# EAGLE design H0BR40 (EAGLE 9.3.0)

## Sheet 1 of 2
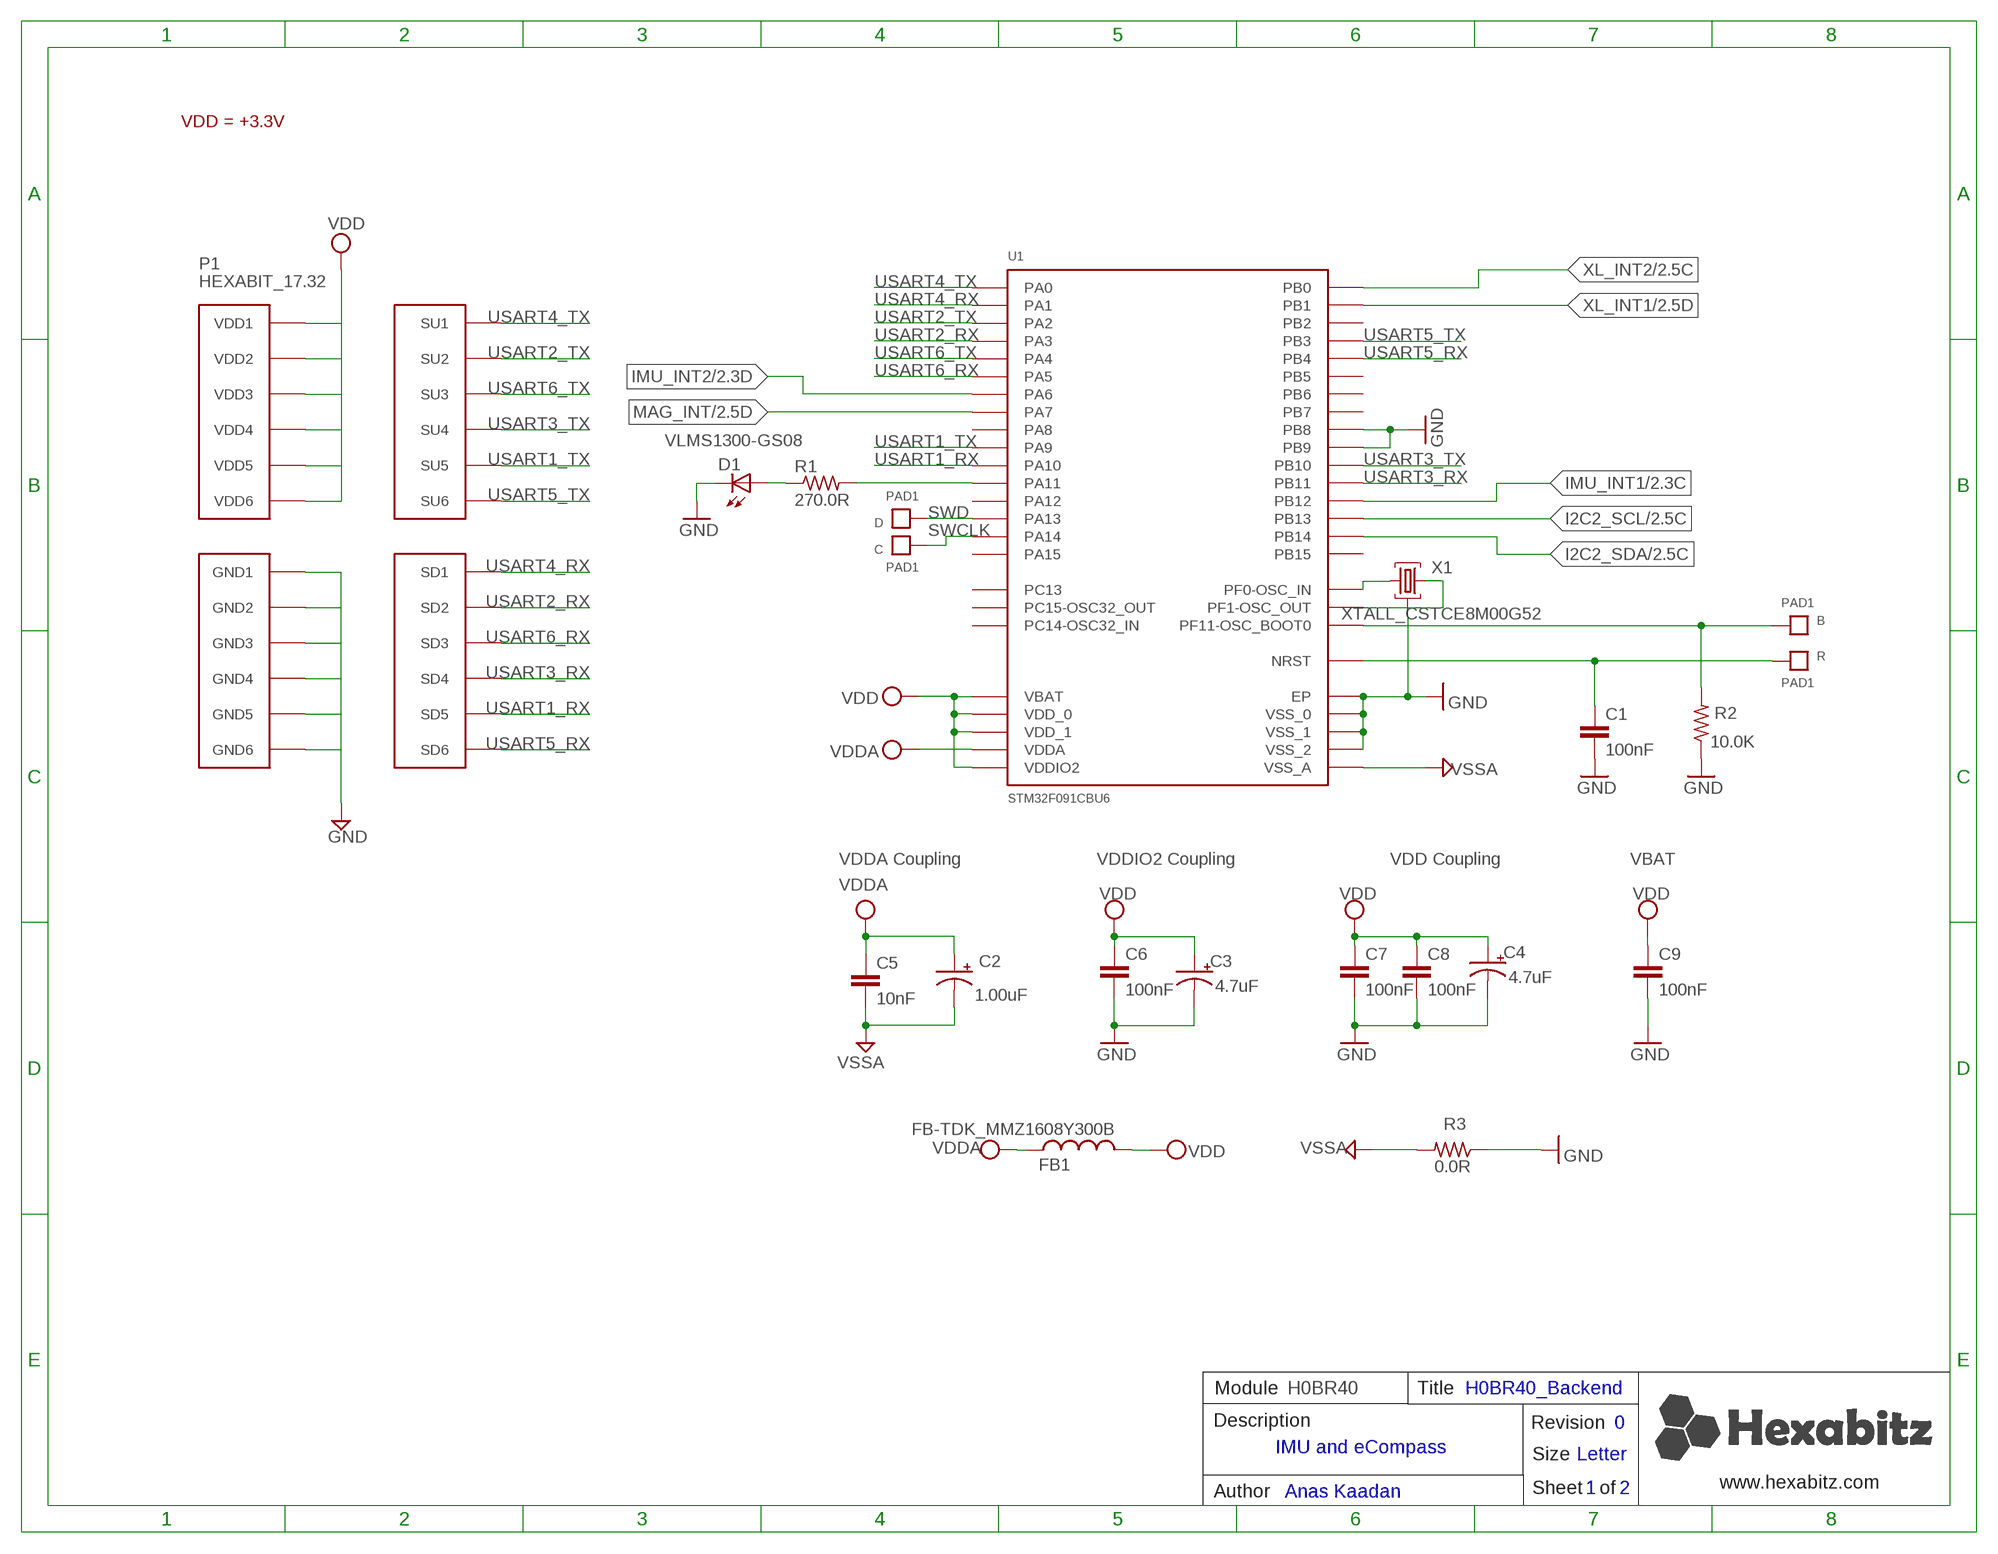
[diagram p0: schematic, sheet 1]

### Parts
B  PAD1  [PAD1]
C  PAD1  [PAD1]
C1  100nF  C-0603  [C-0603]
C2  1.00uF  C-0805-POL  [C-0805-POL]
C3  4.7uF  C-0805-POL  [C-0805-POL]
C4  4.7uF  C-0805-POL  [C-0805-POL]
C5  10nF  C-0603  [C-0603]
C6  100nF  C-0603  [C-0603]
C7  100nF  C-0603  [C-0603]
C8  100nF  C-0603  [C-0603]
C9  100nF  C-0603  [C-0603]
D  PAD1  [PAD1]
D1  VLMS1300-GS08  [VLMS1300-GS08]
FB1  FB-TDK_MMZ1608Y300B  [FB-TDK_MMZ1608Y300B]
P1  HEXABIT_17.32  [HEXABIT_17.32]
R  PAD1  [PAD1]
R1  270.0R  R-0603  [R-0603]
R2  10.0K  R-0603  [R-0603]
R3  0.0R  R-0603  [R-0603]
U1  STM32F091CBU6  [STM32F091CBU6]
X1  XTALL_CSTCE8M00G52  [XTALL_CSTCE8M00G52]

### Nets
B1: B.P$1 B.P$2 R2.2 U1.P$44(PF11-OSC_BOOT0)
GND: C1.2 C3.2(-) C4.2(-) C6.2 C7.2 C8.2 C9.2 D1.C P1.PAD_PD7(GND1) P1.PAD_PD8(GND2) P1.PAD_PD9(GND3) P1.PAD_PD10(GND4) P1.PAD_PD11(GND5) P1.PAD_PD12(GND6) R2.1 R3.1 U1.EP U1.P$23(VSS_0) U1.P$35(VSS_1) U1.P$45(PB8) U1.P$46(PB9) U1.P$47(VSS_2) X1.P$2 ; also sheet 2
I2C2_SCL: U1.P$26(PB13) ; also sheet 2
I2C2_SDA: U1.P$27(PB14) ; also sheet 2
IMU_INT1: U1.P$25(PB12) ; also sheet 2
IMU_INT2: U1.P$16(PA6) ; also sheet 2
MAG_INT: U1.P$17(PA7) ; also sheet 2
N$3: R1.2 U1.P$32(PA11)
N$4: D1.A R1.1
N$5: U1.P$5(PF0-OSC_IN) X1.P$1
N$6: U1.P$6(PF1-OSC_OUT) X1.P$3
R1: C1.1 R.P$1 R.P$2 U1.P$7(NRST)
SWCLK: C.P$1 C.P$2 U1.P$37(PA14)
SWD: D.P$1 D.P$2 U1.P$34(PA13)
USART1_RX: P1.PAD_PD5(SD5) U1.P$31(PA10)
USART1_TX: P1.PAD_PU5(SU5) U1.P$30(PA9)
USART2_RX: P1.PAD_PD2(SD2) U1.P$13(PA3)
USART2_TX: P1.PAD_PU2(SU2) U1.P$12(PA2)
USART3_RX: P1.PAD_PD4(SD4) U1.P$22(PB11)
USART3_TX: P1.PAD_PU4(SU4) U1.P$21(PB10)
USART4_RX: P1.PAD_PD1(SD1) U1.P$11(PA1)
USART4_TX: P1.PAD_PU1(SU1) U1.P$10(PA0)
USART5_RX: P1.PAD_PD6(SD6) U1.P$40(PB4)
USART5_TX: P1.PAD_PU6(SU6) U1.P$39(PB3)
USART6_RX: P1.PAD_PD3(SD3) U1.P$15(PA5)
USART6_TX: P1.PAD_PU3(SU3) U1.P$14(PA4)
VDD: C3.1(+) C4.1(+) C6.1 C7.1 C8.1 C9.1 FB1.2 P1.PAD_PU7(VDD1) P1.PAD_PU8(VDD2) P1.PAD_PU9(VDD3) P1.PAD_PU10(VDD4) P1.PAD_PU11(VDD5) P1.PAD_PU12(VDD6) U1.P$1(VBAT) U1.P$24(VDD_0) U1.P$36(VDDIO2) U1.P$48(VDD_1) ; also sheet 2
VDDA: C2.1(+) C5.1 FB1.1 U1.P$9(VDDA)
VSSA: C2.2(-) C5.2 R3.2 U1.P$8(VSS_A)
XL_INT1: U1.P$19(PB1) ; also sheet 2
XL_INT2: U1.P$18(PB0) ; also sheet 2
Unconnected: U1.P$2(PC13) U1.P$3(PC14-OSC32_IN) U1.P$4(PC15-OSC32_OUT) U1.P$20(PB2) U1.P$28(PB15) U1.P$29(PA8) U1.P$33(PA12) U1.P$38(PA15) U1.P$41(PB5) U1.P$42(PB6) U1.P$43(PB7)

### Notes on the sheet
- VDD = +3.3V
- VDDA Coupling | VDDIO2 Coupling | VDD Coupling | VBAT
- Module | H0BR40 | Title | H0BR40_Backend
- Description | Revision | 0
- IMU and eCompass
- Size | Letter
- www.hexabitz.com
- Author | Anas Kaadan | Sheet   of | 1 | 2
- C:/Users/Admin/Desktop/logodraft.bmp

## Sheet 2 of 2
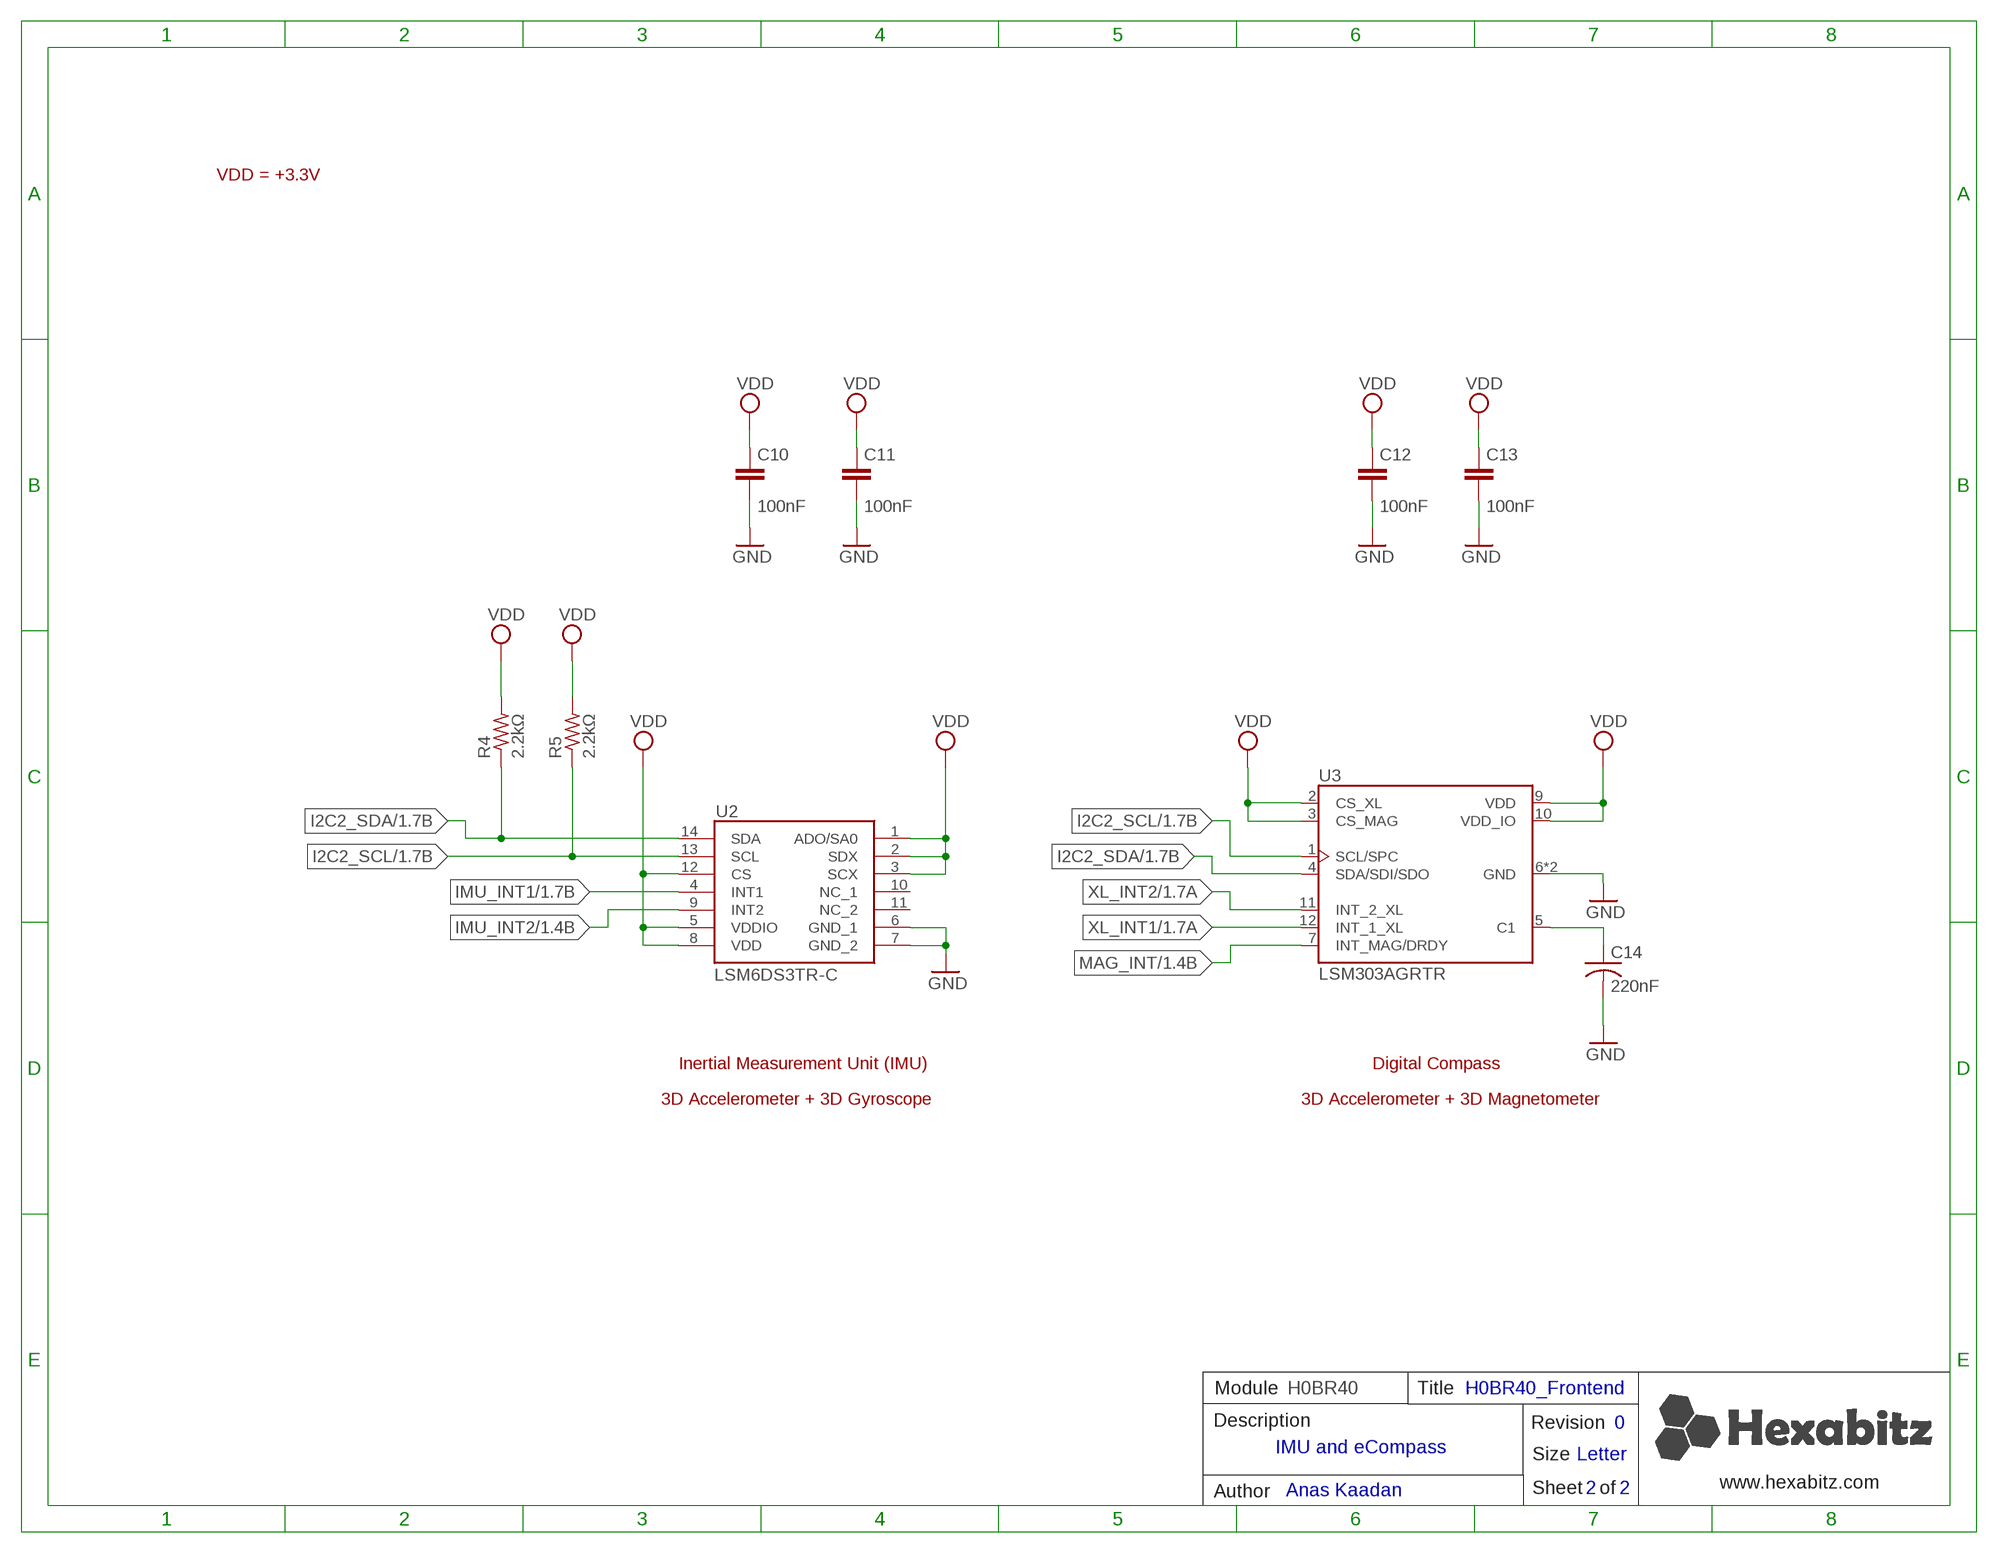
[diagram p1: schematic, sheet 2]

### Parts
C10  100nF  C-0603  [C-0603]
C11  100nF  C-0603  [C-0603]
C12  100nF  C-0603  [C-0603]
C13  100nF  C-0603  [C-0603]
C14  220nF  C-0805  [C-0805]
R4  2.2kΩ  R-0603  [R-0603]
R5  2.2kΩ  R-0603  [R-0603]
U2  LSM6DS3TR-C  [LGA-14(2.5X3X0.86)]
U3  LSM303AGRTR  [LGA12R50P_200X200X100]

### Nets
GND: C10.2 C11.2 C12.2 C13.2 C14.2 U2.6(GND_1) U2.7(GND_2) U3.6(GND) U3.8(GND) ; also sheet 1
I2C2_SCL: R5.1 U2.13(SCL) U3.1(SCL/SPC) ; also sheet 1
I2C2_SDA: R4.1 U2.14(SDA) U3.4(SDA/SDI/SDO) ; also sheet 1
IMU_INT1: U2.4(INT1) ; also sheet 1
IMU_INT2: U2.9(INT2) ; also sheet 1
MAG_INT: U3.7(INT_MAG/DRDY) ; also sheet 1
N$1: C14.1 U3.5(C1)
VDD: C10.1 C11.1 C12.1 C13.1 R4.2 R5.2 U2.1(ADO/SA0) U2.2(SDX) U2.3(SCX) U2.5(VDDIO) U2.8(VDD) U2.12(CS) U3.2(CS_XL) U3.3(CS_MAG) U3.9(VDD) U3.10(VDD_IO) ; also sheet 1
XL_INT1: U3.12(INT_1_XL) ; also sheet 1
XL_INT2: U3.11(INT_2_XL) ; also sheet 1
Unconnected: U2.10(NC_1) U2.11(NC_2)

### Notes on the sheet
- VDD = +3.3V
- Inertial Measurement Unit (IMU) | Digital Compass
- 3D Accelerometer + 3D Gyroscope | 3D Accelerometer + 3D Magnetometer
- Module | H0BR40 | Title | H0BR40_Frontend
- Description | Revision | 0
- IMU and eCompass
- Size | Letter
- www.hexabitz.com
- Author | Anas Kaadan | Sheet   of | 2 | 2

## Library data of the parts
B C D R = Hexabitz:PAD1
C1 C6-C8 = Hexabitz:C-0603: CAP CER 10% X7R 0603; CAPACITANCE: 100nF; MFN: AVX; MPN: 0603YC104K4T2A; OCTOPART_URL: https://octopart.com/0603yc104k4t2a-avx+interconnect+%2F+elco-8120651; TOLERANCE: 10%; VOLTAGE_RATING: 16.0 V
C2 = Hexabitz:C-0805-POL: Cap Tant Solid SMD 2012; CAPACITANCE: 1.00uF; MFN: AVX; MPN: TAJR105M016RNJ; OCTOPART_URL: http://octopart.com/tajr105m016rnj-avx-1188552; TOLERANCE: 10%; VOLTAGE_RATING: 16.0 V
C3 = Hexabitz:C-0805-POL: Cap Tant Solid SMD 2012; CAPACITANCE: 4.7uF; MFN: Panasonic; MPN: 10TPU4R7MSI; OCTOPART_URL: https://octopart.com/10tpu4r7msi-panasonic-29487748; TOLERANCE: 20%; VOLTAGE_RATING: 10.0 V
C4 = Hexabitz:C-0805-POL: Cap Tant Solid SMD 2012; CAPACITANCE: 4.7uF; MFN: Panasonic; MPN: 10TPU4R7MSI; OCTOPART_URL: https://octopart.com/10tpu4r7msi-panasonic-29487748; TOLERANCE: 10%; VOLTAGE_RATING: 10 V
C5 = Hexabitz:C-0603: CAP CER 10% X7R 0603; CAPACITANCE: 10nF; MFN: AVX; MPN: 0603YC103KAT4A; OCTOPART_URL: https://octopart.com/0603yc103kat4a-avx+interconnect+%2F+elco-2550362; TOLERANCE: 10%; VOLTAGE_RATING: 16.0 V
C9 = Hexabitz:C-0603: CAP CER 10% X7R 0603; CAPACITANCE: 100nF; MFN: AVX; MPN: 0603YC104K4T2A; OCTOPART_URL: https://octopart.com/0603yc104k4t2a-avx+interconnect+%2F+elco-8120651; TOLERANCE: 16.0 V; VOLTAGE_RATING: 10%
C10-C13 = Hexabitz:C-0603: CAP CER 10% X7R 0603; CAPACITANCE: 100nF; MFN: AVX; MPN: 0603YC104K4T2A; OCTOPART_URL: https://octopart.com/0603yc104k4t2a-avx+interconnect+%2F+elco-8120651; TOLERANCE: ±10%; VOLTAGE_RATING: 16.0V
C14 = Hexabitz:C-0805; CAPACITANCE: 220nF; MFN: KEMET; MPN: C0805C224K1RACTU; OCTOPAR_URL: https://octopart.com/c0805c224k1ractu-kemet-12818106; TOLERANCE: ±10%; VOLTAGE_RATING: 100.0V
D1 = Hexabitz:VLMS1300-GS08: Red 0603 130° Clear 54 mcd 2 V Surface Mount ChipLED ; Octopart Url : http://octopart.com/vlms1300-gs08-vishay-21709201; MFN: Vishay; MPN: VLMS1300-GS08; OCTOPART_URL: https://octopart.com/vlms1300-gs08-vishay-21709201?r=sp&s=_gcP4_q8T1SC6PJQPTQ9yA
FB1 = Hexabitz:FB-TDK_MMZ1608Y300B: Ferrite Beads Multi-Layer 30Ohm 25% 100MHz 1.5A 50mOhm DCR 0603; MFN: TDK; MPN: MMZ1608Y300B; OCTOPART_URL: https://octopart.com/mmz1608y300b-tdk-368280?r=sp&s=cd9_2ZEqQ9q9UNBuQgHAiA
P1 = Hexabitz:HEXABIT_?: Hexabitz Hexagon Module Connector Hexagon side length = 17.32mm.
R1 = Hexabitz:R-0603: Thick Film Resistors - SMD 0603; MFN: Panasonic; MPN: ERJ-3GEYJ271V; OCTOPART_URL: https://octopart.com/erj-3geyj271v-panasonic-55560546; RESISTANCE: 270.0 Ohm; TOLERANCE: 5%
R2 = Hexabitz:R-0603: Thick Film Resistors - SMD 0603; MFN: Vishay; MPN: CRCW060310K0JNEB; OCTOPART_URL: https://octopart.com/crcw060310k0jneb-vishay-46603269; RESISTANCE: 10.0K Ohm; TOLERANCE: 5%
R3 = Hexabitz:R-0603: Thick Film Resistors - SMD 0603; MFN: Vishay; MPN: CRCW06030000Z0EAHP; OCTOPART_URL: https://octopart.com/crcw06030000z0eahp-vishay-44320230; RESISTANCE: 0.0 Ohm
R4 = Hexabitz:R-0603: Thick Film Resistors - SMD 0603; MFN: Vishay; MPN: CRCW06032K20FKEA; OCTOPART_URL: https://octopart.com/crcw06032k20fkea-vishay-40018987; RESISTANCE: 2.2kΩ; TOLERANCE: ±1%
R5 = Hexabitz:R-0603: Thick Film Resistors - SMD 0603; MFN: Vishay; MPN: CRCW06032K20FKEA; OCTOPART_URL: https://octopart.com/crcw06032k20fkea-vishay-40018987; RESISTANCE: 2.2 kΩ; TOLERANCE: ±1%
U1 = Hexabitz:STM32F091CBU6: Description : ARM-based 32-bit MCU, CAN, 12 timers, ADC, DAC & Comm. Interface, 2 to 3.6 V, -40 to 85 degC, 48-Pin UFQFPN, RoHS, Tray ;Parameter : Ciiva URL : https://ciiva.com/part/STM32F091CBU6-20240708, CiivaID : 20240708, Clock Speed : 48000000.0 Hz, Lifecycle Status : Active, Mounting Style : Surface Mount, Number of Pins : 48, Octopart Url : https://octopart.com/stm32f091cbu6-stmicroelectronics-51988677, OctopartID : 5f4f955c32ec8088, RAM Memory Size : 32768 B, REACH SVHC Compliance : No SVHC, RoHS : Compliant,; MFN: STMicroelectronics; MPN: STM32F091CBU6; OCTOPART_URL: https://octopart.com/stm32f091cbu6-stmicroelectronics-51988677?r=sp&s=bU6fpgsrTZOxHyt7jkfh3w
U2 = Hexabitz:LSM6DS3TR-C: STMicroelectronics iNEMO inertial module: 3D accelerometer and 3D gyroscope Source: Datasheet <http://www.st.com/resource/en/datasheet/lsm6ds3tr-c.pdf>; DESCRIPTION: STMicroelectronics iNEMO inertial module: 3D accelerometer and 3D gyroscope; HEIGHT: mm; MFN: STMicroelectronics; MPN: LSM6DS3TR-C; OCTOPART_ID: b93b7300354766fc; OCTOPART_URL: https://www.mouser.com/Search/Refine.aspx?Keyword=N%2FA
U3 = Hexabitz:LSM303AGRTR: Ultra-compact high-performance e-compass 3D accelerometer and 3D magnetometer module; DESCRIPTION: Ultra-compact high-performance e-compass 3D accelerometer and 3D magnetometer module; MFN: STMicroelectronics; MPN: LSM303AGRTR; OCTOPART_ID: 497-16527-1-ND; OCTOPART_URL: https://www.digikey.com/product-detail/en/stmicroelectronics/LSM303AGRTR/497-16527-1-ND/6006105?utm_source=snapeda&utm_medium=aggregator&utm_campaign=symbol; PACKAGE: LGA-12 STMicroelectronics
X1 = Hexabitz:XTALL_CSTCE8M00G52: MURATA CSTCE8M00G52-R0 RESONATOR, SMD, 8MHZ ; Octopart Url : https://octopart.com/cstce8m00g52-r0-murata-7145559; MFN: Murata; MPN: CSTCE8M00G52Z-R0; OCTOPART_URL: https://octopart.com/cstce8m00g52z-r0-murata-17755941?r=sp&s=JDnNJnrHQhyS8Zk4ofFWXw

## Board
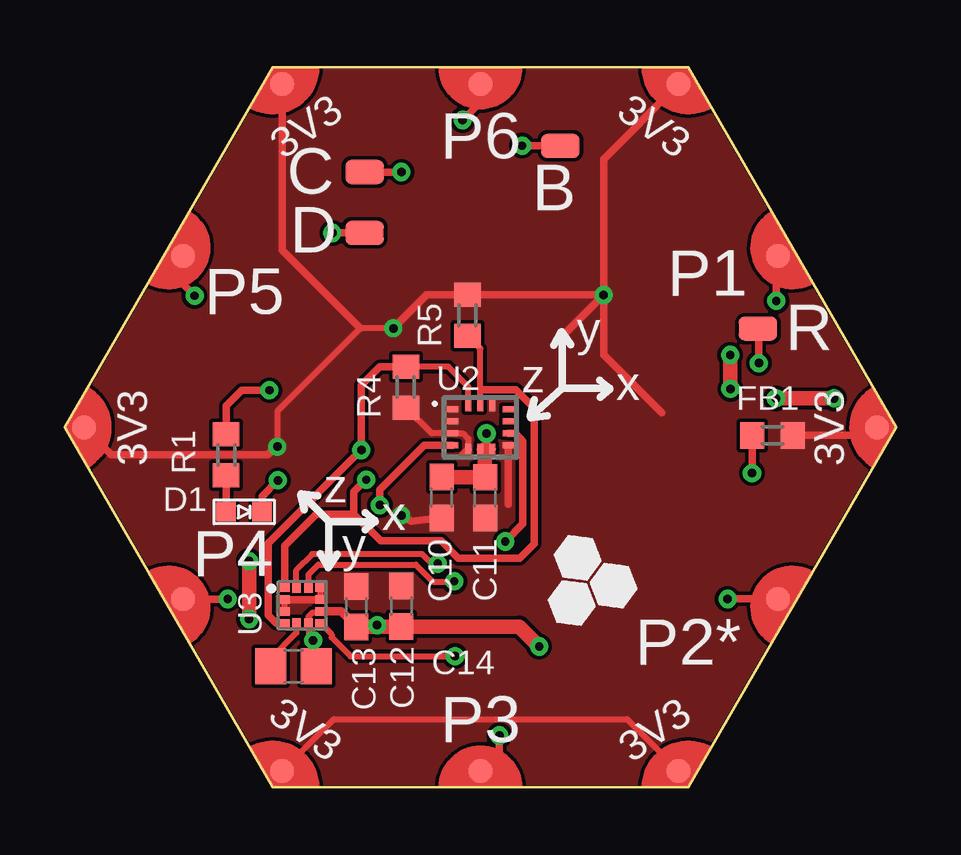
[diagram p2: board, top side]
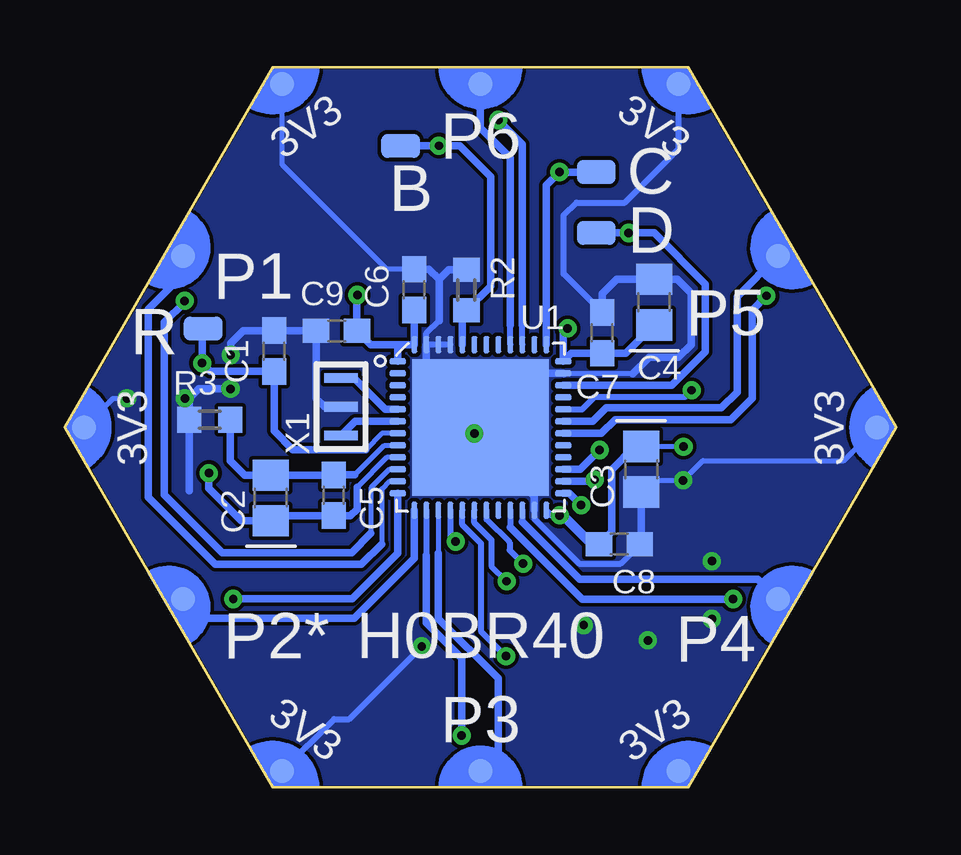
[diagram p3: board, bottom side, seen from below]

Size 34.64 x 30 mm. Coordinates in mm from the lower left corner, seen from the top.
Copper layers (1*16): Top 0.035mm / dielectric 1.5mm / Bottom 0.035mm
Design rules "2_layer": minimum track width 7mil, minimum drill 10mil, track to track 6mil, track to pad 6mil, pad to pad 6mil, via to via 6mil, smd to smd 0mil, copper to edge 1mil, drill to drill 8mil, minimum pad ring 10mil, minimum via ring 8mil, stop-mask expansion 2mil, vias tented up to drill 15mil, thermal gap 10mil

### Footprints (pad centres in the part's own frame; a part is rotated, then mirrored left to right if it is on the bottom)
PAD1 = smd 1.6 x 1: P$1 0,0 | smd 1.6 x 1 bottom: P$2 0,0
C-0603 = smd 1.1 x 1: 1 -0.85,0; 2 0.85,0
C-0805-POL = smd 1.3 x 1.5: 1 -0.95,0; 2 0.95,0
C-0805 = smd 1.3 x 1.5: 1 -0.95,0; 2 0.95,0
VLMS1300-GS08 = smd 0.8 x 0.8: A 0,0.75; C 0,-0.75
FB-TDK_MMZ1608Y300B = smd 1 x 1.1: 1 -0.85,0; 2 0.85,0
HEXABIT_17.32 = smd 1 x 1 bottom: PAD_PD1 12.39,7.15; PAD_PD2 12.39,-7.15; PAD_PD3 0,-14.31; PAD_PD4 -12.39,-7.15; PAD_PD5 -12.39,7.15; PAD_PD6 0,14.31; PAD_PD7 8.26,14.31; PAD_PD8 16.52,0; PAD_PD9 8.26,-14.31; PAD_PD10 -8.26,-14.31; PAD_PD11 -16.52,0; PAD_PD12 -8.26,14.31 | smd 1 x 1: PAD_PU1 12.39,7.15; PAD_PU2 12.39,-7.15; PAD_PU3 0,-14.31; PAD_PU4 -12.39,-7.15; PAD_PU5 -12.39,7.15; PAD_PU6 0,14.31; PAD_PU7 8.26,14.31; PAD_PU8 16.52,0; PAD_PU9 8.26,-14.31; PAD_PU10 -8.26,-14.31; PAD_PU11 -16.52,0; PAD_PU12 -8.26,14.31
R-0603 = smd 1 x 1.1: 1 -0.85,0; 2 0.85,0
STM32F091CBU6 = smd 5.7 x 5.7: EP 0,0 | smd 0.25 x 0.7: P$1 -2.75,-3.45; P$2 -2.25,-3.45; P$3 -1.75,-3.45; P$4 -1.25,-3.45; P$5 -0.75,-3.45; P$6 -0.25,-3.45; P$7 0.25,-3.45; P$8 0.75,-3.45; P$9 1.25,-3.45; P$10 1.75,-3.45; P$11 2.25,-3.45; P$12 2.75,-3.45; P$25 2.75,3.45; P$26 2.25,3.45; P$27 1.75,3.45; P$28 1.25,3.45; P$29 0.75,3.45; P$30 0.25,3.45; P$31 -0.25,3.45; P$32 -0.75,3.45; P$33 -1.25,3.45; P$34 -1.75,3.45; P$35 -2.25,3.45; P$36 -2.75,3.45 | smd 0.7 x 0.25: P$13 3.45,-2.75; P$14 3.45,-2.25; P$15 3.45,-1.75; P$16 3.45,-1.25; P$17 3.45,-0.75; P$18 3.45,-0.25; P$19 3.45,0.25; P$20 3.45,0.75; P$21 3.45,1.25; P$22 3.45,1.75; P$23 3.45,2.25; P$24 3.45,2.75; P$37 -3.45,2.75; P$38 -3.45,2.25; P$39 -3.45,1.75; P$40 -3.45,1.25; P$41 -3.45,0.75; P$42 -3.45,0.25; P$43 -3.45,-0.25; P$44 -3.45,-0.75; P$45 -3.45,-1.25; P$46 -3.45,-1.75; P$47 -3.45,-2.25; P$48 -3.45,-2.75
LGA-14(2.5X3X0.86) = smd 0.475 x 0.25: 1 -1.163,0.75; 2 -1.163,0.25; 3 -1.163,-0.25; 4 -1.163,-0.75; 8 1.163,-0.75; 9 1.163,-0.25; 10 1.163,0.25; 11 1.163,0.75 | smd 0.25 x 0.475: 5 -0.5,-0.912; 6 0,-0.912; 7 0.5,-0.912; 12 0.5,0.912; 13 0,0.912; 14 -0.5,0.912
LGA12R50P_200X200X100 = smd 0.45 x 0.35: 1 -0.76,0.75; 2 -0.76,0.25; 3 -0.76,-0.25; 4 -0.76,-0.75; 7 0.76,-0.75; 8 0.76,-0.25; 9 0.76,0.25; 10 0.76,0.75 | smd 0.35 x 0.45: 5 -0.25,-0.76; 6 0.25,-0.76; 11 0.25,0.76; 12 -0.25,0.76
XTALL_CSTCE8M00G52 = smd 1.4 x 0.4: P$1 0,1.2; P$2 0,0; P$3 0,-1.2

### Placement (x,y rotation side)
B  20.65,26.73 0 top
C  12.49,25.64 0 top
C1  25.91,18.18 90 bottom
C2  26.06,12.06 90 bottom
C3  10.62,13.26 270 bottom
C4  10.09,20.22 90 bottom
C5  23.43,12.17 90 bottom
C6  20.09,20.74 90 bottom
C7  12.25,18.94 90 bottom
C8  11.53,10.13 0 bottom
C9  23.32,19.03 180 bottom
C10  15.71,12.08 90 top
C11  17.52,12.07 90 top
C12  14.03,7.55 270 top
C13  12.14,7.53 270 top
C14  9.53,5.05 0 top
D  12.49,23.1 180 top
D1  7.47,11.49 90 top
FB1  29.49,14.67 0 top
P1  17.32,15 0 top
R  28.88,19.11 0 top
R1  6.72,13.86 90 top
R2  17.91,20.73 270 bottom
R3  28.6,15.32 0 bottom
R4  14.21,16.68 270 top
R5  16.78,19.67 90 top
U1  17.32,15 270 bottom
U2  17.32,15 0 top
U3  9.9,7.58 0 top
X1  23.13,15.86 0 bottom

### Tracks (layer width: path | path; a pad name or v marks a point on that pad's centre or on a via)
B1  (via drill 0.35)
  Top 0.305: B.P$1 v19.06,26.73 v19.05,26.74
  Bottom 0.305: U1.P$44 18.07,19.72 R2.2 16.9,20.89 16.9,25.44 18.19,26.74 v19.05,26.74 B.P$1
GND  (via drill 0.35)
  Top 0.254: U3.8 10.62,7.29 10.32,7.29 10.16,7.12 U3.6 10.16,6.32 v10.35,6.13 | 12.14,7.02 C13.2 12.01,6.68
  Top 0.305: v17.57,14.75 17.57,14.34 U2.6 17.5,14.09 U2.7 | 11.78,6.32 C13.2 | D1.C 8.22,12.13 v8.88,12.79
  Top 0.356: U3.8 11.52,7.33 12.15,6.7
  Top 0.406: v10.35,6.13 10.35,5.18 C14.2
  Top 0.61: C10.2 C11.2 17.5,12.95 17.5,14.09 | C13.2 12.15,6.7 C12.2 18.94,6.7 v19.77,5.87 | v7.68,9.43 v7.68,7.02 | v29.63,16.21 v32.05,16.21 | v27.73,18.01 27.73,16.61 v27.74,16.6
  Bottom 0.203: 19.04,19.45 19.04,19.46 | 10.97,17.24 13.86,17.24 | P1.PAD_PD8 32.63,16.21 v32.05,16.21 | C6.2 21.22,21.59 25.58,25.95 P1.PAD_PD7 | C3.2 10.14,12.79 v8.88,12.79 8.05,13.62 2.18,13.62 P1.PAD_PD11
  Bottom 0.254: 19.04,19.45 19.57,18.93 U1.P$47 U1.P$46 U1.P$45 | P1.PAD_PD9 23.42,2.85 22.79,2.85 v19.77,5.87 | C7.2 13.85,21.4 13.85,23.83 13.31,24.37 11.3,24.37 9.06,26.61 P1.PAD_PD12 | U1.P$23 15.07,11.19 13.21,9.33 11.48,9.33 C8.2
  Bottom 0.305: X1.P$2 23.81,15.86 24.16,16.2 24.16,19.02 C9.2 C1.2 | C1.2 | 19.04,19.45 19.04,21.17 | C6.2 19.46,21.59 19.04,21.17 | 19.04,21.17 18.64,21.58 R2.1 | C7.2 12.25,20.56 11.64,21.17 C4.2 9.12,21.17 8.54,20.59 8.54,18.45 9.08,17.92 10.29,17.92 10.97,17.24 | 13.86,17.24 U1.P$35 14.87,17.25 15.07,17.05 17.57,17.05 | C8.2 10.62,10.19 C3.2 | 29.45,12.36 R3.1 29.45,16.22 29.07,16.6 v27.74,16.6 | v27.73,18.01 27.73,18.51 27.2,19.03 C1.2 | 17.32,12.62 | 17.57,17.05 19.56,17.05 19.57,17.06 U1.P$47 | v17.57,14.75 17.57,17.05 | U1.P$23 15.07,12.14 15.54,12.61 17.31,12.61 17.32,12.62
  other vias: 13.01,6.76
  pour Bottom (no thermals): 8.66,0 25.98,0 34.64,15 25.98,30 8.66,30 0,15
I2C2_SCL  (via drill 0.35)
  Top 0.203: 17.33,16.58 17.32,16.59
  Top 0.254: U2.13 17.32,16.59 17.32,18.28 R5.1
  Top 0.305: 17.33,16.58 18.78,16.58 19.57,15.79 19.57,10.16 18.96,9.56 16.4,9.56 15.68,10.27 13.16,10.27 12.05,11.39 | U3.1 9.17,8.36 9.17,10.07 10.49,11.39 12.05,11.39 | v12.56,12.82 12.05,12.31 12.05,11.39
  Bottom 0.305: U1.P$26 12.63,12.75 v12.56,12.82
I2C2_SDA  (via drill 0.35)
  Top 0.254: U2.14 16.82,16.69 15.98,17.53 R4.1
  Top 0.305: R4.1 13.12,17.53 12.36,16.76 v12.36,14.06 8.48,10.18 8.48,7.17 8.81,6.83 U3.4
  Bottom 0.305: v12.36,14.06 13.17,13.25 U1.P$27
IMU_INT1  (via drill 0.35)
  Top 0.305: v13.13,11.76 13.13,12.39 14.98,14.25 U2.4
  Bottom 0.305: U1.P$25 13.62,12.25 v13.13,11.76
IMU_INT2  (via drill 0.35)
  Top 0.305: U2.9 18.78,14.75 19.02,14.5 19.02,14.49 19.09,14.43 19.09,10.98 v18.35,10.24
  Bottom 0.254: U1.P$16 18.57,10.46 v18.35,10.24
MAG_INT  (via drill 0.35)
  Top 0.254: v16.26,5.47 16.25,5.46 11.91,5.46 11.11,6.25 11.11,6.38 U3.7
  Bottom 0.254: v16.26,5.47 17.3,6.52 17.3,10.17 18.07,10.94 U1.P$17
N$1
  Top 0.254: U3.5 9.65,6.44 8.58,5.37 C14.1
N$3  (via drill 0.35)
  Top 0.305: v8.52,16.55 v8.51,16.54 7.37,16.54 6.72,15.9 R1.2
  Bottom 0.254: U1.P$32 13.09,15.75 12.57,16.27 8.8,16.27 v8.52,16.55
N$4
  Top 0.305: R1.1 D1.A
N$5
  Bottom 0.305: U1.P$5 21.29,15.75 22.61,17.06 X1.P$1
N$6
  Bottom 0.305: U1.P$6 22.54,15.25 X1.P$3
R1  (via drill 0.35)
  Top 0.305: R.P$1 28.92,19.07 v28.92,17.68
  Bottom 0.203: U1.P$7 21.43,14.75 22.1,14.07
  Bottom 0.305: 22.1,14.07 25.13,14.07 25.92,14.86 C1.1 28.57,17.33 v28.92,17.68 28.92,19.07 R.P$1
SWCLK  (via drill 0.35)
  Top 0.305: C.P$1 v14.02,25.64
  Bottom 0.305: U1.P$37 14.57,25.1 v14.02,25.64 C.P$1
SWD  (via drill 0.35)
  Top 0.305: D.P$1 v11.15,23.1
  Bottom 0.305: U1.P$34 9.35,16.75 7.95,18.15 7.95,20.96 10.09,23.1 v11.15,23.1 D.P$1
USART1_RX
  Bottom 0.305: U1.P$31 12.63,15.25 12.07,15.81 7.28,15.81 6.63,16.46 6.63,20.45 P1.PAD_PD5
USART1_TX  (via drill 0.35)
  Top 0.305: v5.41,20.48 4.93,20.96 P1.PAD_PU5
  Bottom 0.305: U1.P$30 12.29,14.75 11.71,15.33 6.89,15.33 6,16.22 6,19.89 v5.41,20.48
USART2_RX
  Bottom 0.305: U1.P$13 20.07,9.55 22.58,7.04 28.9,7.04 P1.PAD_PD2
USART2_TX  (via drill 0.35)
  Top 0.305: v27.62,7.85 P1.PAD_PU2
  Bottom 0.305: v27.62,7.85 22.67,7.85 20.76,9.76 U1.P$12
USART3_RX
  Bottom 0.254: U1.P$22 15.57,11.07
  Bottom 0.305: 15.57,11.07 13.18,8.68 5.76,8.68 P1.PAD_PD4
USART3_TX  (via drill 0.35)
  Top 0.305: v6.79,7.85 P1.PAD_PU4 | P1.PAD_PU4
  Bottom 0.254: U1.P$21 16.07,10.85
  Bottom 0.305: v6.79,7.85 13.07,7.85 16.07,10.85
USART4_RX
  Bottom 0.203: U1.P$11 21.12,12.75 21.43,12.43 21.43,10.14 | 29.71,21.37 P1.PAD_PD1
  Bottom 0.305: 21.43,10.14 22.28,9.29 28.36,9.29 31.16,12.08 31.16,19.92 29.71,21.37
USART4_TX  (via drill 0.35)
  Top 0.305: P1.PAD_PU1 29.65,22.09 v29.65,20.27
  Bottom 0.203: U1.P$10 21.12,13.25 21.89,12.48 21.89,10.58 | 29.65,20.21 v29.65,20.27
  Bottom 0.305: 29.65,20.21 30.49,19.37 30.49,12.19 28.08,9.78 22.69,9.78 21.89,10.58
USART5_RX
  Bottom 0.203: 16.07,19.27
  Bottom 0.254: U1.P$40 16.07,19.27
  Bottom 0.305: 16.07,19.27 16.07,26.23 17.32,27.48 P1.PAD_PD6 | P1.PAD_PD6
USART5_TX  (via drill 0.35)
  Top 0.305: v16.58,27.81 17.32,28.55 P1.PAD_PU6
  Bottom 0.203: 15.57,19.27 15.56,19.27
  Bottom 0.254: U1.P$39 15.57,19.27
  Bottom 0.305: 15.57,19.27 15.57,26.8 v16.58,27.81
USART6_RX
  Bottom 0.203: U1.P$15 19.07,9.76
  Bottom 0.305: 19.07,9.76 19.07,7.04 16.58,4.55 16.58,1.43 P1.PAD_PD3
USART6_TX  (via drill 0.35)
  Top 0.305: v18.11,2.16 18.11,1.48 P1.PAD_PU3
  Bottom 0.203: U1.P$14
  Bottom 0.254: U1.P$14 19.57,9.67
  Bottom 0.305: v18.11,2.16 v18.1,2.16 18.1,5.39 19.57,6.86 19.57,9.67
VDD  (via drill 0.35)
  Top 0.203: U2.3 | U2.5
  Top 0.254: U3.2 U3.3 | U3.9 U3.10 | U2.5 16.82,14.53 16.6,14.75 U2.3 15.29,14.75 R4.2 | v13.69,19.13 12.31,19.13 8.86,15.68 8.86,14.25 v8.86,14.2 | P1.PAD_PU9 25.58,0.85 P1.PAD_PU9 | P1.PAD_PU10 11.21,2.84 23.43,2.84 P1.PAD_PU9
  Top 0.305: C10.1 14.44,11.08 v14.02,11.34 | U2.5 16.59,13.86 | v22.45,20.52 22.45,26.18 P1.PAD_PU7 | v13.69,19.13 15.08,20.52 R5.2 18.26,20.52 v22.45,20.52 | U2.8 18.48,11.79 | U3.2 9.33,7.83 9.35,7.81 10.45,7.81 10.47,7.83 U3.9 | FB1.2 33.51,14.67 P1.PAD_PU8 | 24.86,15.62 22.45,18.03 v22.45,20.51 v22.45,20.52 | 20.42,18.49 v22.45,20.52 | P1.PAD_PU12 9.06,22.38 12.31,19.13 | P1.PAD_PU11 1.94,13.86 8.46,13.86 8.86,14.25
  Bottom 0.203: v8.86,14.2 C3.1
  Bottom 0.254: U1.P$24 14.36,11.34 v14.02,11.34
  Bottom 0.305: 20.77,18.45 21.89,18.45 C9.1 22.47,20.5 v22.45,20.52 | 20.77,18.45 U1.P$48 20.07,19.87 C6.1 | U1.P$1 20.77,18.45 | C4.1 11.26,18.09 C7.1 13.53,18.09 U1.P$36 13.87,18.95 v13.69,19.13 | C3.1 10.89,14.21 11.85,13.24 11.85,10.66 C8.1 12.68,10.13
  Bottom 0.406: v14.02,11.34 13.9,11.34 12.68,10.13
  pour Top (no thermals): 8.66,0 25.98,0 34.64,15 25.98,30 8.66,30 0,15
VDDA  (via drill 0.35)
  Top 0.305: v28.64,13.1 FB1.1
  Bottom 0.203: U1.P$9 21.22,13.75 22.46,12.51
  Bottom 0.305: 22.46,12.51 22.46,11.6 22.74,11.32 C5.1 25.85,11.32 C2.1 27.29,11.11 28.64,12.46 v28.64,13.1
VSSA
  Bottom 0.203: 22.55,13.02 21.32,14.25 U1.P$8
  Bottom 0.305: R3.2 27.74,13.61 27.15,13.01 C2.2 C5.2 22.55,13.02
XL_INT1  (via drill 0.35)
  Top 0.254: U3.12 9.65,9.07 10.3,9.72 14.89,9.72 15.29,9.31 v15.53,9.31 v15.54,9.32
  Bottom 0.254: U1.P$19 17.07,11.17 16.11,10.21 16.11,9.89 v15.54,9.32
XL_INT2  (via drill 0.35)
  Top 0.254: U3.11 10.15,8.59 10.16,8.59 10.16,8.88 10.57,9.29 14.62,9.29 15.34,8.57 16.21,8.57 v16.23,8.59
  Bottom 0.254: v16.23,8.59 16.86,9.22 16.86,10.31 17.57,11.02 U1.P$18

### Text on the board
tPlace: 3V3 | P6 | 3V3 | P1 | P5 | y | z | x | 3V3 | 3V3 | z | x | P4 | y | P2* | 3V3 | P3 | 3V3
bPlace: 3V3 | P6 | 3V3 | P1 | P5 | 3V3 | 3V3 | P4 | H0BR40 | P2* | 3V3 | P3 | 3V3
bNames: C | B | D | R